# Altium schematic sheet as14120_fpga_power_conf.SchDoc
size A2
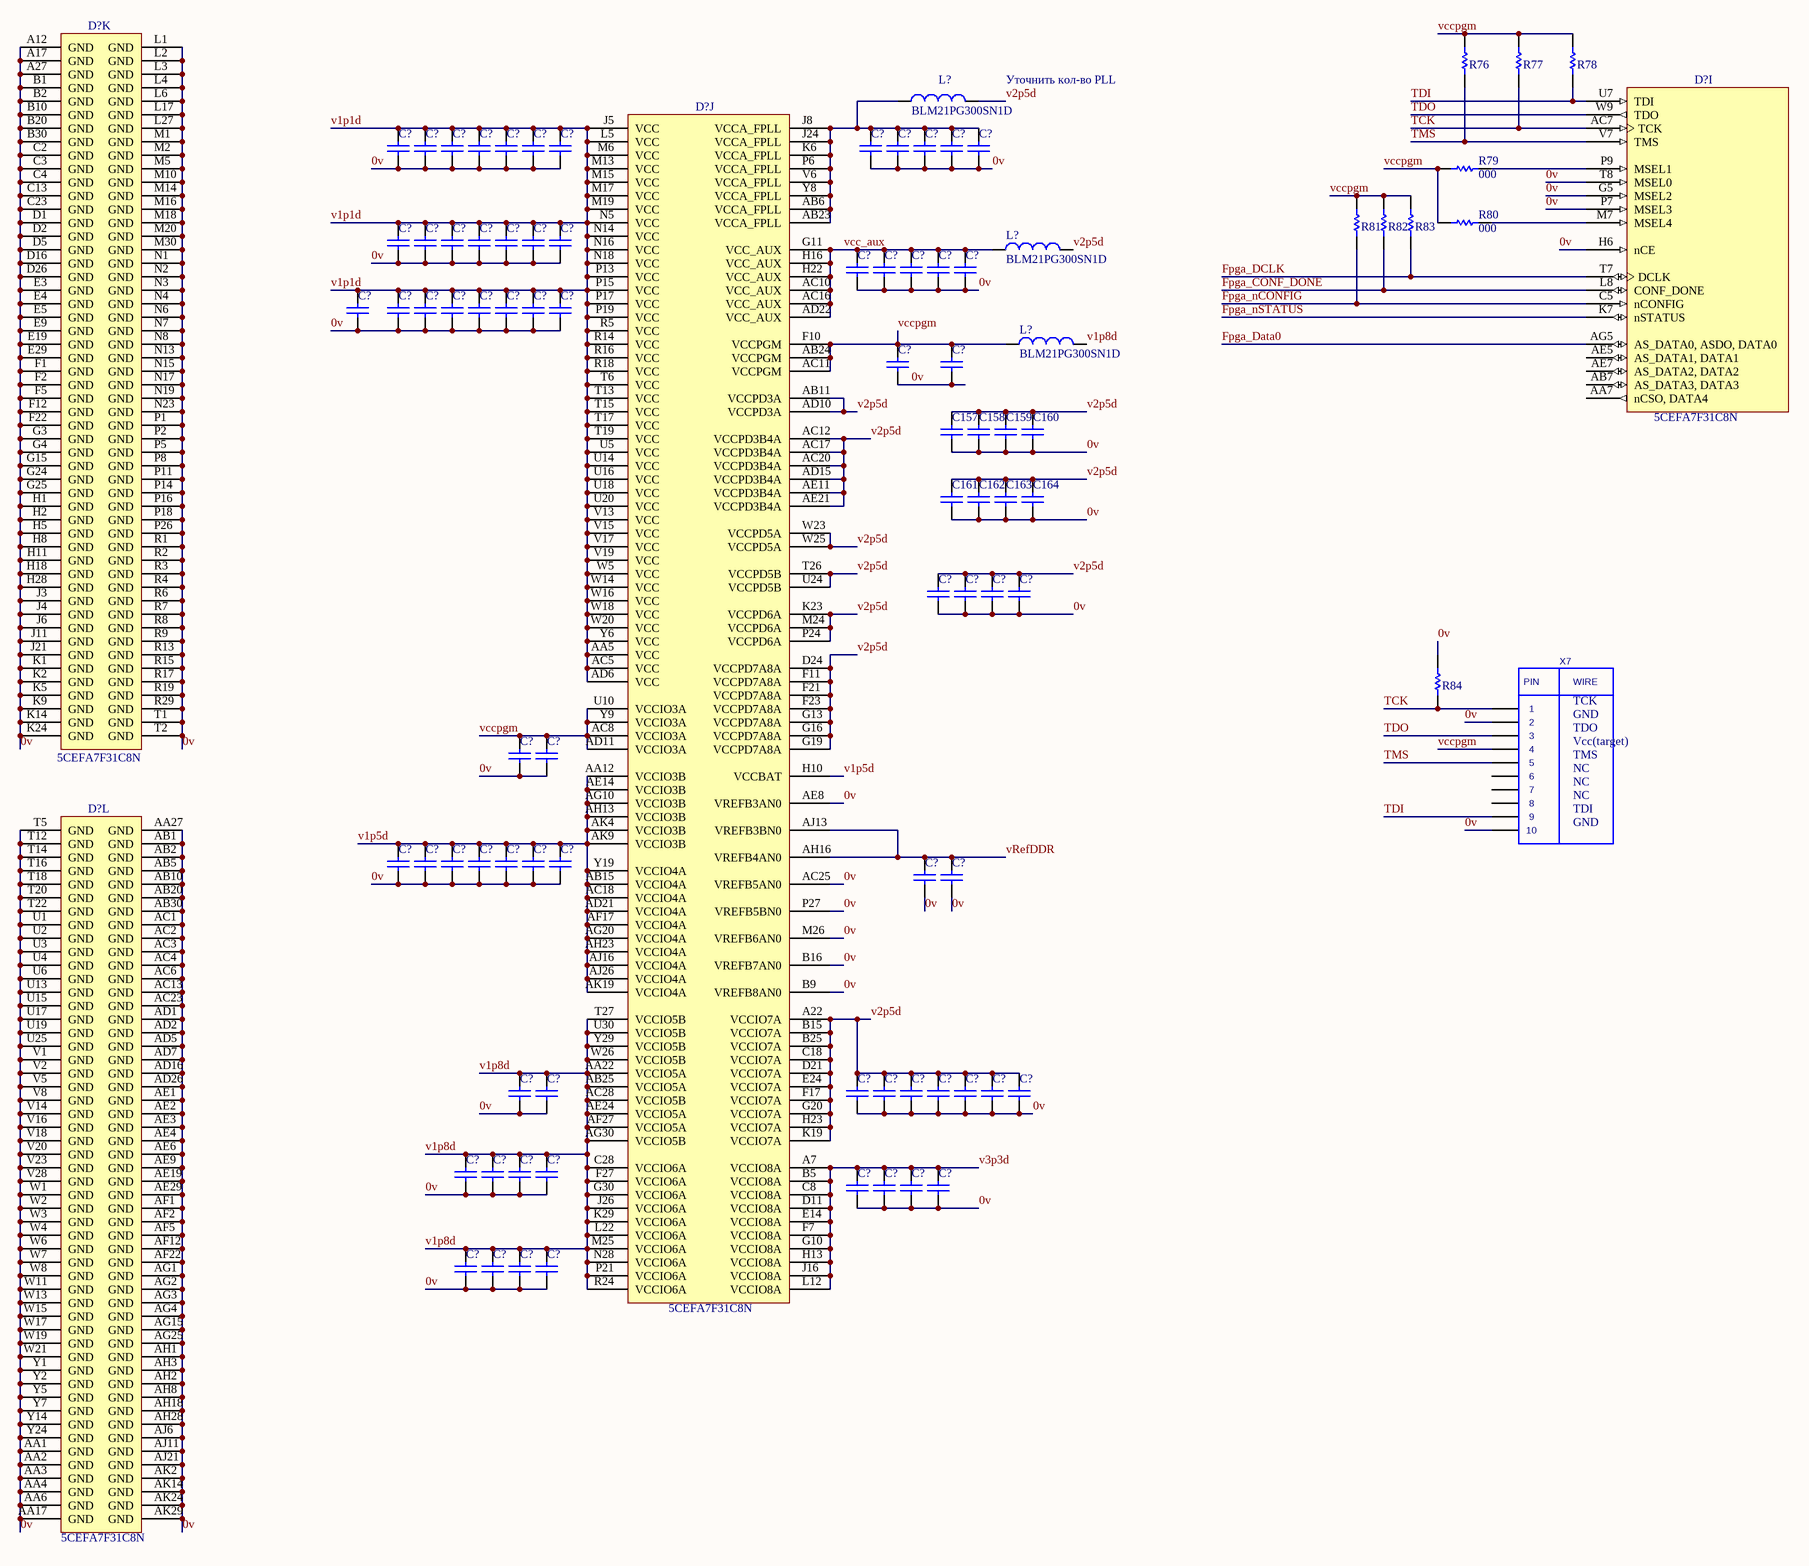
[diagram p0: as14120_fpga_power_conf.SchDoc]

## Parts
(Parts that share a designator on the sheet are numbered #1, #2 ... from top to bottom, then left to right.)
C157  CAP 1uF 10V 0402(1005)  [CAPC0402(1005)60_M]  (value not drawn)
C158  CAP 1uF 10V 0402(1005)  [CAPC0402(1005)60_M]  (value not drawn)
C159  CAP 1uF 10V 0402(1005)  [CAPC0402(1005)60_M]  (value not drawn)
C160  CAP 1uF 10V 0402(1005)  [CAPC0402(1005)60_M]  (value not drawn)
C161  CAP 1uF 10V 0402(1005)  [CAPC0402(1005)60_M]  (value not drawn)
C162  CAP 1uF 10V 0402(1005)  [CAPC0402(1005)60_M]  (value not drawn)
C163  CAP 1uF 10V 0402(1005)  [CAPC0402(1005)60_M]  (value not drawn)
C164  CAP 1uF 10V 0402(1005)  [CAPC0402(1005)60_M]  (value not drawn)
C?#1  CAP 1uF 10V 0402(1005)  [CAPC0402(1005)60_M]  (value not drawn)
C?#2  CAP 1uF 10V 0402(1005)  [CAPC0402(1005)60_M]  (value not drawn)
C?#3  CAP 1uF 10V 0402(1005)  [CAPC0402(1005)60_M]  (value not drawn)
C?#4  CAP 1uF 10V 0402(1005)  [CAPC0402(1005)60_M]  (value not drawn)
C?#5  CAP 1uF 10V 0402(1005)  [CAPC0402(1005)60_M]  (value not drawn)
C?#6  CAP 1uF 10V 0402(1005)  [CAPC0402(1005)60_M]  (value not drawn)
C?#7  CAP 1uF 10V 0402(1005)  [CAPC0402(1005)60_M]  (value not drawn)
C?#8  CAP 1uF 10V 0402(1005)  [CAPC0402(1005)60_M]  (value not drawn)
C?#9  CAP 1uF 10V 0402(1005)  [CAPC0402(1005)60_M]  (value not drawn)
C?#10  CAP 1uF 10V 0402(1005)  [CAPC0402(1005)60_M]  (value not drawn)
C?#11  CAP 1uF 10V 0402(1005)  [CAPC0402(1005)60_M]  (value not drawn)
C?#12  CAP 1uF 10V 0402(1005)  [CAPC0402(1005)60_M]  (value not drawn)
C?#13  CAP 1uF 10V 0402(1005)  [CAPC0402(1005)60_M]  (value not drawn)
C?#14  CAP 1uF 10V 0402(1005)  [CAPC0402(1005)60_M]  (value not drawn)
C?#15  CAP 1uF 10V 0402(1005)  [CAPC0402(1005)60_M]  (value not drawn)
C?#16  CAP 1uF 10V 0402(1005)  [CAPC0402(1005)60_M]  (value not drawn)
C?#17  CAP 1uF 10V 0402(1005)  [CAPC0402(1005)60_M]  (value not drawn)
C?#18  CAP 1uF 10V 0402(1005)  [CAPC0402(1005)60_M]  (value not drawn)
C?#19  CAP 1uF 10V 0402(1005)  [CAPC0402(1005)60_M]  (value not drawn)
C?#20  CAP 1uF 10V 0402(1005)  [CAPC0402(1005)60_M]  (value not drawn)
C?#21  CAP 1uF 10V 0402(1005)  [CAPC0402(1005)60_M]  (value not drawn)
C?#22  CAP 1uF 10V 0402(1005)  [CAPC0402(1005)60_M]  (value not drawn)
C?#23  CAP 1uF 10V 0402(1005)  [CAPC0402(1005)60_M]  (value not drawn)
C?#24  CAP 1uF 10V 0402(1005)  [CAPC0402(1005)60_M]  (value not drawn)
C?#25  CAP 1uF 10V 0402(1005)  [CAPC0402(1005)60_M]  (value not drawn)
C?#26  CAP 1uF 10V 0402(1005)  [CAPC0402(1005)60_M]  (value not drawn)
C?#27  CAP 1uF 10V 0402(1005)  [CAPC0402(1005)60_M]  (value not drawn)
C?#28  CAP 1uF 10V 0402(1005)  [CAPC0402(1005)60_M]  (value not drawn)
C?#29  CAP 1uF 10V 0402(1005)  [CAPC0402(1005)60_M]  (value not drawn)
C?#30  CAP 1uF 10V 0402(1005)  [CAPC0402(1005)60_M]  (value not drawn)
C?#31  CAP 1uF 10V 0402(1005)  [CAPC0402(1005)60_M]  (value not drawn)
C?#32  CAP 1uF 10V 0402(1005)  [CAPC0402(1005)60_M]  (value not drawn)
C?#33  CAP 1uF 10V 0402(1005)  [CAPC0402(1005)60_M]  (value not drawn)
C?#34  CAP 1uF 10V 0402(1005)  [CAPC0402(1005)60_M]  (value not drawn)
C?#35  CAP 1uF 10V 0402(1005)  [CAPC0402(1005)60_M]  (value not drawn)
C?#36  CAP 1uF 10V 0402(1005)  [CAPC0402(1005)60_M]  (value not drawn)
C?#37  CAP 1uF 10V 0402(1005)  [CAPC0402(1005)60_M]  (value not drawn)
C?#38  CAP 1uF 10V 0402(1005)  [CAPC0402(1005)60_M]  (value not drawn)
C?#39  CAP 1uF 10V 0402(1005)  [CAPC0402(1005)60_M]  (value not drawn)
C?#40  CAP 1uF 10V 0402(1005)  [CAPC0402(1005)60_M]  (value not drawn)
C?#41  CAP 1uF 10V 0402(1005)  [CAPC0402(1005)60_M]  (value not drawn)
C?#42  CAP 1uF 10V 0402(1005)  [CAPC0402(1005)60_M]  (value not drawn)
C?#43  CAP 1uF 10V 0402(1005)  [CAPC0402(1005)60_M]  (value not drawn)
C?#44  CAP 1uF 10V 0402(1005)  [CAPC0402(1005)60_M]  (value not drawn)
C?#45  CAP 1uF 10V 0402(1005)  [CAPC0402(1005)60_M]  (value not drawn)
C?#46  CAP 1uF 10V 0402(1005)  [CAPC0402(1005)60_M]  (value not drawn)
C?#47  CAP 1uF 10V 0402(1005)  [CAPC0402(1005)60_M]  (value not drawn)
C?#48  CAP 1uF 10V 0402(1005)  [CAPC0402(1005)60_M]  (value not drawn)
C?#49  CAP 1uF 10V 0402(1005)  [CAPC0402(1005)60_M]  (value not drawn)
C?#50  CAP 1uF 10V 0402(1005)  [CAPC0402(1005)60_M]  (value not drawn)
C?#51  CAP 1uF 10V 0402(1005)  [CAPC0402(1005)60_M]  (value not drawn)
C?#52  CAP 1uF 10V 0402(1005)  [CAPC0402(1005)60_M]  (value not drawn)
C?#53  CAP 1uF 10V 0402(1005)  [CAPC0402(1005)60_M]  (value not drawn)
C?#54  CAP 1uF 10V 0402(1005)  [CAPC0402(1005)60_M]  (value not drawn)
C?#55  CAP 1uF 10V 0402(1005)  [CAPC0402(1005)60_M]  (value not drawn)
C?#56  CAP 1uF 10V 0402(1005)  [CAPC0402(1005)60_M]  (value not drawn)
C?#57  CAP 1uF 10V 0402(1005)  [CAPC0402(1005)60_M]  (value not drawn)
C?#58  CAP 1uF 10V 0402(1005)  [CAPC0402(1005)60_M]  (value not drawn)
C?#59  CAP 1uF 10V 0402(1005)  [CAPC0402(1005)60_M]  (value not drawn)
C?#60  CAP 1uF 10V 0402(1005)  [CAPC0402(1005)60_M]  (value not drawn)
C?#61  CAP 1uF 10V 0402(1005)  [CAPC0402(1005)60_M]  (value not drawn)
C?#62  CAP 1uF 10V 0402(1005)  [CAPC0402(1005)60_M]  (value not drawn)
C?#63  CAP 1uF 10V 0402(1005)  [CAPC0402(1005)60_M]  (value not drawn)
C?#64  CAP 1uF 10V 0402(1005)  [CAPC0402(1005)60_M]  (value not drawn)
C?#65  CAP 1uF 10V 0402(1005)  [CAPC0402(1005)60_M]  (value not drawn)
C?#66  CAP 1uF 10V 0402(1005)  [CAPC0402(1005)60_M]  (value not drawn)
C?#67  CAP 1uF 10V 0402(1005)  [CAPC0402(1005)60_M]  (value not drawn)
C?#68  CAP 1uF 10V 0402(1005)  [CAPC0402(1005)60_M]  (value not drawn)
C?#69  CAP 1uF 10V 0402(1005)  [CAPC0402(1005)60_M]  (value not drawn)
C?#70  CAP 1uF 10V 0402(1005)  [CAPC0402(1005)60_M]  (value not drawn)
D?#1  5CEFA7F31C8N  [ALTR-896-FBGA-2000A]  (part K of 13)
D?#2  5CEFA7F31C8N  [ALTR-896-FBGA-2000A]  (part I of 13)
D?#3  5CEFA7F31C8N  [ALTR-896-FBGA-2000A]  (part J of 13)
D?#4  5CEFA7F31C8N  [ALTR-896-FBGA-2000A]  (part L of 13)
L?#1  BLM21PG300SN1D  [CAPC0805(2012)100_N]
L?#2  BLM21PG300SN1D  [CAPC0805(2012)100_N]
L?#3  BLM21PG300SN1D  [CAPC0805(2012)100_N]
R76  1K 5% 0603(1608)  [RESC0603(1608)_L]  (value not drawn)
R77  1K 5% 0603(1608)  [RESC0603(1608)_L]  (value not drawn)
R78  1K 5% 0603(1608)  [RESC0603(1608)_L]  (value not drawn)
R79  value 000  [RESC0603(1608)_L]  (hidden comment: 1K 5% 0603(1608))
R80  value 000  [RESC0603(1608)_L]  (hidden comment: 1K 5% 0603(1608))
R81  1K 5% 0603(1608)  [RESC0603(1608)_L]  (value not drawn)
R82  1K 5% 0603(1608)  [RESC0603(1608)_L]  (value not drawn)
R83  1K 5% 0603(1608)  [RESC0603(1608)_L]  (value not drawn)
R84  1K 5% 0603(1608)  [RESC0603(1608)_L]  (value not drawn)
X7  IDC10  [IDC10M]  (value not drawn)

## Nets
0v: C157.1 C158.1 C159.1 C160.1 C161.1 C162.1 C163.1 C164.1 C?#1.1 C?#2.1 C?#3.1 C?#4.1 C?#5.1 C?#6.1 C?#7.1 C?#8.1 C?#9.1 C?#10.1 C?#11.1 C?#12.1 C?#13.1 C?#14.1 C?#15.1 C?#16.1 C?#17.1 C?#18.1 C?#19.1 C?#20.1 C?#21.1 C?#22.1 C?#23.1 C?#24.1 C?#25.1 C?#26.1 C?#27.1 C?#28.1 C?#29.1 C?#30.1 C?#31.1 C?#32.1 C?#33.1 C?#34.1 C?#35.1 C?#36.1 C?#37.1 C?#38.1 C?#39.1 C?#40.1 C?#41.1 C?#42.1 C?#43.1 C?#44.1 C?#45.1 C?#46.1 C?#47.1 C?#48.1 C?#49.1 C?#50.1 C?#51.1 C?#52.1 C?#53.1 C?#54.1 C?#55.1 C?#56.1 C?#57.1 C?#58.1 C?#59.1 C?#60.1 C?#61.1 C?#62.1 C?#63.1 C?#64.1 C?#65.1 C?#66.1 C?#67.1 C?#68.1 C?#69.1 C?#70.1 D?#1.A12(GND) D?#1.A17(GND) D?#1.A27(GND) D?#1.B1(GND) D?#1.B2(GND) D?#1.B10(GND) D?#1.B20(GND) D?#1.B30(GND) D?#1.C2(GND) D?#1.C3(GND) D?#1.C4(GND) D?#1.C13(GND) D?#1.C23(GND) D?#1.D1(GND) D?#1.D2(GND) D?#1.D5(GND) D?#1.D16(GND) D?#1.D26(GND) D?#1.E3(GND) D?#1.E4(GND) D?#1.E5(GND) D?#1.E9(GND) D?#1.E19(GND) D?#1.E29(GND) D?#1.F1(GND) D?#1.F2(GND) D?#1.F5(GND) D?#1.F12(GND) D?#1.F22(GND) D?#1.G3(GND) D?#1.G4(GND) D?#1.G15(GND) D?#1.G24(GND) D?#1.G25(GND) D?#1.H1(GND) D?#1.H2(GND) D?#1.H5(GND) D?#1.H8(GND) D?#1.H11(GND) D?#1.H18(GND) D?#1.H28(GND) D?#1.J3(GND) D?#1.J4(GND) D?#1.J6(GND) D?#1.J11(GND) D?#1.J21(GND) D?#1.K1(GND) D?#1.K2(GND) D?#1.K5(GND) D?#1.K9(GND) D?#1.K14(GND) D?#1.K24(GND) D?#1.L1(GND) D?#1.L2(GND) D?#1.L3(GND) D?#1.L4(GND) D?#1.L6(GND) D?#1.L17(GND) D?#1.L27(GND) D?#1.M1(GND) D?#1.M2(GND) D?#1.M5(GND) D?#1.M10(GND) D?#1.M14(GND) D?#1.M16(GND) D?#1.M18(GND) D?#1.M20(GND) D?#1.M30(GND) D?#1.N1(GND) D?#1.N2(GND) D?#1.N3(GND) D?#1.N4(GND) D?#1.N6(GND) D?#1.N7(GND) D?#1.N8(GND) D?#1.N13(GND) D?#1.N15(GND) D?#1.N17(GND) D?#1.N19(GND) D?#1.N23(GND) D?#1.P1(GND) D?#1.P2(GND) D?#1.P5(GND) D?#1.P8(GND) D?#1.P11(GND) D?#1.P14(GND) D?#1.P16(GND) D?#1.P18(GND) D?#1.P26(GND) D?#1.R1(GND) D?#1.R2(GND) D?#1.R3(GND) D?#1.R4(GND) D?#1.R6(GND) D?#1.R7(GND) D?#1.R8(GND) D?#1.R9(GND) D?#1.R13(GND) D?#1.R15(GND) D?#1.R17(GND) D?#1.R19(GND) D?#1.R29(GND) D?#1.T1(GND) D?#1.T2(GND) D?#2.G5(MSEL2) D?#2.H6(nCE) D?#2.P7(MSEL3) D?#2.T8(MSEL0) D?#3.AC25(VREFB5AN0) D?#3.AE8(VREFB3AN0) D?#3.B9(VREFB8AN0) D?#3.B16(VREFB7AN0) D?#3.M26(VREFB6AN0) D?#3.P27(VREFB5BN0) D?#4.AA1(GND) D?#4.AA2(GND) D?#4.AA3(GND) D?#4.AA4(GND) D?#4.AA6(GND) D?#4.AA17(GND) D?#4.AA27(GND) D?#4.AB1(GND) D?#4.AB2(GND) D?#4.AB5(GND) D?#4.AB10(GND) D?#4.AB20(GND) D?#4.AB30(GND) D?#4.AC1(GND) D?#4.AC2(GND) D?#4.AC3(GND) D?#4.AC4(GND) D?#4.AC6(GND) D?#4.AC13(GND) D?#4.AC23(GND) D?#4.AD1(GND) D?#4.AD2(GND) D?#4.AD5(GND) D?#4.AD7(GND) D?#4.AD16(GND) D?#4.AD26(GND) D?#4.AE1(GND) D?#4.AE2(GND) D?#4.AE3(GND) D?#4.AE4(GND) D?#4.AE6(GND) D?#4.AE9(GND) D?#4.AE19(GND) D?#4.AE29(GND) D?#4.AF1(GND) D?#4.AF2(GND) D?#4.AF5(GND) D?#4.AF12(GND) D?#4.AF22(GND) D?#4.AG1(GND) D?#4.AG2(GND) D?#4.AG3(GND) D?#4.AG4(GND) D?#4.AG15(GND) D?#4.AG25(GND) D?#4.AH1(GND) D?#4.AH2(GND) D?#4.AH3(GND) D?#4.AH8(GND) D?#4.AH18(GND) D?#4.AH28(GND) D?#4.AJ6(GND) D?#4.AJ11(GND) D?#4.AJ21(GND) D?#4.AK2(GND) D?#4.AK14(GND) D?#4.AK24(GND) D?#4.AK29(GND) D?#4.T5(GND) D?#4.T12(GND) D?#4.T14(GND) D?#4.T16(GND) D?#4.T18(GND) D?#4.T20(GND) D?#4.T22(GND) D?#4.U1(GND) D?#4.U2(GND) D?#4.U3(GND) D?#4.U4(GND) D?#4.U6(GND) D?#4.U13(GND) D?#4.U15(GND) D?#4.U17(GND) D?#4.U19(GND) D?#4.U25(GND) D?#4.V1(GND) D?#4.V2(GND) D?#4.V5(GND) D?#4.V8(GND) D?#4.V14(GND) D?#4.V16(GND) D?#4.V18(GND) D?#4.V20(GND) D?#4.V23(GND) D?#4.V28(GND) D?#4.W1(GND) D?#4.W2(GND) D?#4.W3(GND) D?#4.W4(GND) D?#4.W6(GND) D?#4.W7(GND) D?#4.W8(GND) D?#4.W11(GND) D?#4.W13(GND) D?#4.W15(GND) D?#4.W17(GND) D?#4.W19(GND) D?#4.W21(GND) D?#4.Y1(GND) D?#4.Y2(GND) D?#4.Y5(GND) D?#4.Y7(GND) D?#4.Y14(GND) D?#4.Y24(GND) R84.1 X7.2 X7.10
Fpga_CONF_DONE: D?#2.L8(CONF_DONE) R82.2
Fpga_Data0: D?#2.AG5(AS_DATA0,_ASDO,_DATA0)
Fpga_DCLK: D?#2.T7(DCLK) R83.2
Fpga_nCONFIG: D?#2.C5(nCONFIG) R81.2
Fpga_nSTATUS: D?#2.K7(nSTATUS)
TCK: D?#2.AC7(TCK) R77.2 R84.2 X7.1
TDI: D?#2.U7(TDI) R78.1 X7.9
TDO: D?#2.W9(TDO) X7.3
TMS: D?#2.V7(TMS) R76.2 X7.5
v1p1d: C?#1.2 C?#2.2 C?#3.2 C?#4.2 C?#5.2 C?#6.2 C?#7.2 C?#13.2 C?#14.2 C?#15.2 C?#16.2 C?#17.2 C?#18.2 C?#19.2 C?#25.2 C?#26.2 C?#27.2 C?#28.2 C?#29.2 C?#30.2 C?#31.2 C?#32.2 D?#3.AA5(VCC) D?#3.AC5(VCC) D?#3.AD6(VCC) D?#3.J5(VCC) D?#3.L5(VCC) D?#3.M6(VCC) D?#3.M13(VCC) D?#3.M15(VCC) D?#3.M17(VCC) D?#3.M19(VCC) D?#3.N5(VCC) D?#3.N14(VCC) D?#3.N16(VCC) D?#3.N18(VCC) D?#3.P13(VCC) D?#3.P15(VCC) D?#3.P17(VCC) D?#3.P19(VCC) D?#3.R5(VCC) D?#3.R14(VCC) D?#3.R16(VCC) D?#3.R18(VCC) D?#3.T6(VCC) D?#3.T13(VCC) D?#3.T15(VCC) D?#3.T17(VCC) D?#3.T19(VCC) D?#3.U5(VCC) D?#3.U14(VCC) D?#3.U16(VCC) D?#3.U18(VCC) D?#3.U20(VCC) D?#3.V13(VCC) D?#3.V15(VCC) D?#3.V17(VCC) D?#3.V19(VCC) D?#3.W5(VCC) D?#3.W14(VCC) D?#3.W16(VCC) D?#3.W18(VCC) D?#3.W20(VCC) D?#3.Y6(VCC)
v1p5d: C?#41.2 C?#42.2 C?#43.2 C?#44.2 C?#45.2 C?#46.2 C?#47.2 D?#3.AA12(VCCIO3B) D?#3.AB15(VCCIO4A) D?#3.AC18(VCCIO4A) D?#3.AD21(VCCIO4A) D?#3.AE14(VCCIO3B) D?#3.AF17(VCCIO4A) D?#3.AG10(VCCIO3B) D?#3.AG20(VCCIO4A) D?#3.AH13(VCCIO3B) D?#3.AH23(VCCIO4A) D?#3.AJ16(VCCIO4A) D?#3.AJ26(VCCIO4A) D?#3.AK4(VCCIO3B) D?#3.AK9(VCCIO3B) D?#3.AK19(VCCIO4A) D?#3.H10(VCCBAT) D?#3.Y19(VCCIO4A)
v1p8d: C?#50.2 C?#51.2 C?#59.2 C?#60.2 C?#61.2 C?#62.2 C?#67.2 C?#68.2 C?#69.2 C?#70.2 D?#3.AA22(VCCIO5A) D?#3.AB25(VCCIO5A) D?#3.AC28(VCCIO5B) D?#3.AE24(VCCIO5A) D?#3.AF27(VCCIO5A) D?#3.AG30(VCCIO5B) D?#3.C28(VCCIO6A) D?#3.F27(VCCIO6A) D?#3.G30(VCCIO6A) D?#3.J26(VCCIO6A) D?#3.K29(VCCIO6A) D?#3.L22(VCCIO6A) D?#3.M25(VCCIO6A) D?#3.N28(VCCIO6A) D?#3.P21(VCCIO6A) D?#3.R24(VCCIO6A) D?#3.T27(VCCIO5B) D?#3.U30(VCCIO5B) D?#3.W26(VCCIO5B) D?#3.Y29(VCCIO5B) L?#3.2
v2p5d: C157.2 C158.2 C159.2 C160.2 C161.2 C162.2 C163.2 C164.2 C?#35.2 C?#36.2 C?#37.2 C?#38.2 C?#52.2 C?#53.2 C?#54.2 C?#55.2 C?#56.2 C?#57.2 C?#58.2 D?#3.A22(VCCIO7A) D?#3.AB11(VCCPD3A) D?#3.AC12(VCCPD3B4A) D?#3.AC17(VCCPD3B4A) D?#3.AC20(VCCPD3B4A) D?#3.AD10(VCCPD3A) D?#3.AD15(VCCPD3B4A) D?#3.AE11(VCCPD3B4A) D?#3.AE21(VCCPD3B4A) D?#3.B15(VCCIO7A) D?#3.B25(VCCIO7A) D?#3.C18(VCCIO7A) D?#3.D21(VCCIO7A) D?#3.D24(VCCPD7A8A) D?#3.E24(VCCIO7A) D?#3.F11(VCCPD7A8A) D?#3.F17(VCCIO7A) D?#3.F21(VCCPD7A8A) D?#3.F23(VCCPD7A8A) D?#3.G13(VCCPD7A8A) D?#3.G16(VCCPD7A8A) D?#3.G19(VCCPD7A8A) D?#3.G20(VCCIO7A) D?#3.H23(VCCIO7A) D?#3.K19(VCCIO7A) D?#3.K23(VCCPD6A) D?#3.M24(VCCPD6A) D?#3.P24(VCCPD6A) D?#3.T26(VCCPD5B) D?#3.U24(VCCPD5B) D?#3.W23(VCCPD5A) D?#3.W25(VCCPD5A) L?#1.2 L?#2.2
v3p3d: C?#63.2 C?#64.2 C?#65.2 C?#66.2 D?#3.A7(VCCIO8A) D?#3.B5(VCCIO8A) D?#3.C8(VCCIO8A) D?#3.D11(VCCIO8A) D?#3.E14(VCCIO8A) D?#3.F7(VCCIO8A) D?#3.G10(VCCIO8A) D?#3.H13(VCCIO8A) D?#3.J16(VCCIO8A) D?#3.L12(VCCIO8A)
vcc_aux: C?#20.2 C?#21.2 C?#22.2 C?#23.2 C?#24.2 D?#3.AC10(VCC_AUX) D?#3.AC16(VCC_AUX) D?#3.AD22(VCC_AUX) D?#3.G11(VCC_AUX) D?#3.H16(VCC_AUX) D?#3.H22(VCC_AUX) L?#2.1
vccpgm: C?#33.2 C?#34.2 C?#39.2 C?#40.2 D?#3.AB24(VCCPGM) D?#3.AC8(VCCIO3A) D?#3.AC11(VCCPGM) D?#3.AD11(VCCIO3A) D?#3.F10(VCCPGM) D?#3.U10(VCCIO3A) D?#3.Y9(VCCIO3A) L?#3.1 R76.1 R77.1 R78.2 R79.2 R80.2 R81.1 R82.1 R83.1 X7.4
vRefDDR: C?#48.2 C?#49.2 D?#3.AH16(VREFB4AN0) D?#3.AJ13(VREFB3BN0)
NetC?#8_2: C?#8.2 C?#9.2 C?#10.2 C?#11.2 C?#12.2 D?#3.AB6(VCCA_FPLL) D?#3.AB23(VCCA_FPLL) D?#3.J8(VCCA_FPLL) D?#3.J24(VCCA_FPLL) D?#3.K6(VCCA_FPLL) D?#3.P6(VCCA_FPLL) D?#3.V6(VCCA_FPLL) D?#3.Y8(VCCA_FPLL) L?#1.1
NetD?#2_M7: D?#2.M7(MSEL4) R80.1
NetD?#2_P9: D?#2.P9(MSEL1) R79.1

Not connected (* = marked no-connect by the designer): D?#2 AA7(nCSO,_DATA4) AB7(AS_DATA3,_DATA3) AE5(AS_DATA1,_DATA1) AE7(AS_DATA2,_DATA2); X7 6 7 8

## Notes on the sheet
- Уточнить кол-во PLL
- TCK
- GND
- TDO
- Vcc(target)
- TMS
- NC
- TDI
- Title
- Size:
- Date:
- File:
- A2
- Number:
- Time:
- Revision:
- Sheet
- of
- (in symbol IDC10) PIN; WIRE

## Library data of the parts
C157-C164 C?#1-C?#70 = CAP_0402: CAP 1uF 10V ±20% 0402 (1005 Metric) Thickness 0.6mm SMD; Case-Metric: 1005; Case-EIA: 0402; Value: 0.1; Tolerance: ±20%; Max Thickness: 0.6 mm; Rated Voltage: 10 V; Technology: SMT
D?#1-D?#4 = 5CEFA7F31C8N: Cyclone V E Family FPGA, 1.07 to 1.13 V Supply, 480 I/O Pins, 7 PLLs, 896-Pin FBGA, Speed Grade 8, Commercial Grade, RoHS Compliant; Manufacturer: Altera; Device Group: 5CEFA7; GPIO: 480; Logic Elements (LE) (K): 149.5; Speed Grade: 8; DatasheetVersion: Rev. 3.1; PackageReference: 896-FBGA-2000A; PackageDescription: 896-Pin FineLine Ball-Grid Array (FBGA), Body 31 x 31 mm, Pitch 1 mm; Supplier 1: Digi-Key; Supplier Part Number 1: 544-2768-ND; Supplier 2: Mouser; Supplier Part Number 2: 989-5CEFA7F31C8N; RoHS: RoHS Compliant; Subcategory: Cyclone V E; Voltage Supply: 1.07 to 1.13 V; Mounting Technology: Surface Mount; Code_JEDEC: MS-034-AAN-1; PartNumber: 5CEFA7F31C8N; ComponentLink1Description: Manufacturer URL; ComponentLink1URL: http://www.altera.com; ComponentLink2Description: Datasheet; ComponentLink2URL: http://www.altera.com/literature/hb/cyclone-v/cv_51002.pdf; ComponentLink3Description: Package Specification; ComponentLink3URL: http://www.altera.com/devicepackaging/04R00435-01.pdf; ComponentLink4Description: Device Handbook URL; ComponentLink4URL: http://www.altera.com/literature/hb/cyclone-v/cyclone5_handbook.pdf; ComponentLink5Description: Device Overview URL; ComponentLink5URL: http://www.altera.com/literature/hb/cyclone-v/cv_51001.pdf; ComponentLink6Description: Device Pin-Out URL; ComponentLink6URL: http://www.altera.com/literature/dp/cyclone-v/1.1.txt; ComponentLink7Description: Product URL; ComponentLink7URL: http://www.buyaltera.com/scripts/partsearch.dll?Detail&name=5CEFA7F31C8N-ND
L?#1-L?#3 = Ferrite_beat
R76-R78 R81-R83 = RES_0603: 1K 0.1W 5% 0603 (1608 Metric)  SMD; Case-EIA: 0603; Case-Metric: 1608; Value: 10k; Technology: SMT; Tolerance: 5 %; Power: 0.1 W
R79 R80 R84 = RES_0603: 1K 0.1W 5% 0603 (1608 Metric)  SMD; Case-EIA: 0603; Case-Metric: 1608; Technology: SMT; Tolerance: 5 %; Power: 0.1 W
  R84: Value: 1k
X7 = IDC10: Value: *